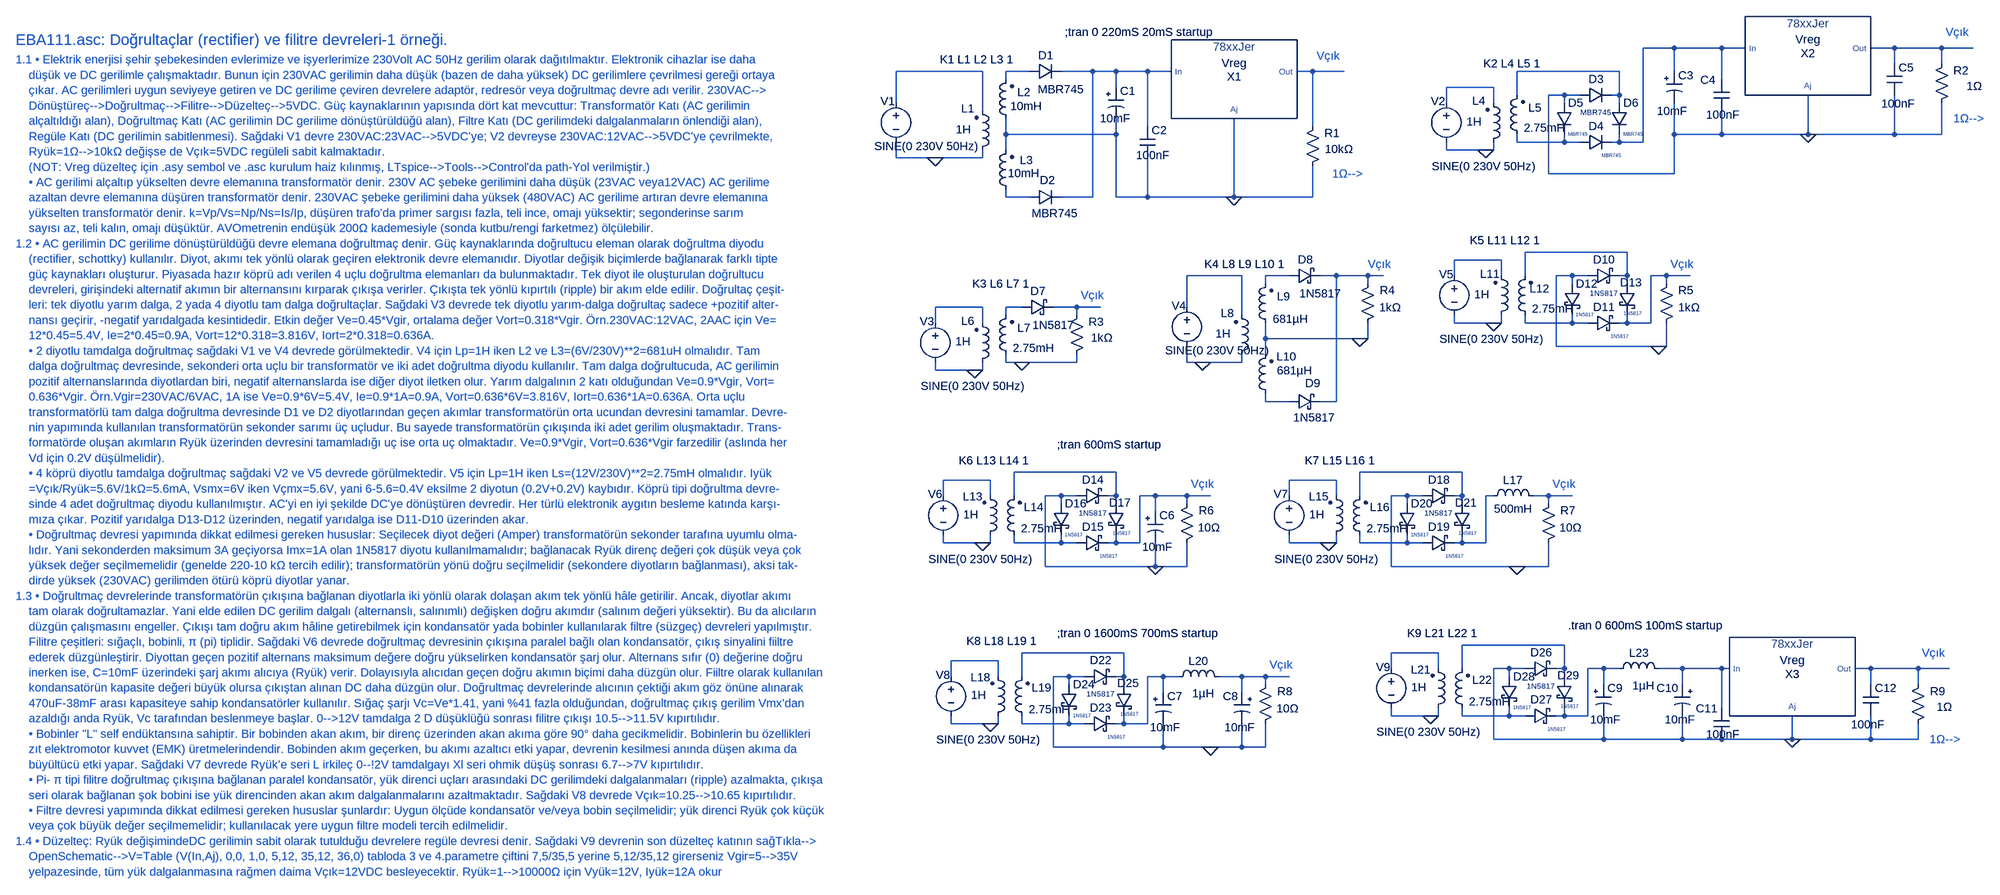
[diagram p0: schematic EBA111.asc]
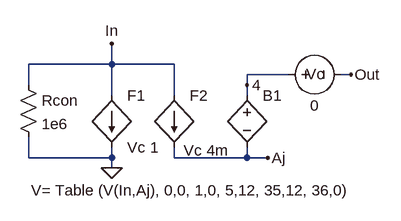
[diagram p1: sub-circuit 7805jerarq.asc]
EBA111.asc, the LTspice schematic file:
Version 4
SHEET 1 4648 4332
WIRE 3328 64 3264 64
WIRE 3424 64 3328 64
WIRE 3472 64 3424 64
WIRE 3776 64 3728 64
WIRE 3872 64 3776 64
WIRE 3936 64 3872 64
WIRE 3776 96 3776 64
WIRE 3872 96 3872 64
WIRE 1920 112 1744 112
WIRE 2016 112 1968 112
WIRE 2144 112 2080 112
WIRE 2192 112 2144 112
WIRE 2256 112 2192 112
WIRE 2304 112 2256 112
WIRE 2592 112 2560 112
WIRE 2656 112 2592 112
WIRE 3216 112 3008 112
WIRE 3328 112 3328 64
WIRE 1968 128 1968 112
WIRE 3424 128 3424 64
WIRE 2192 144 2192 112
WIRE 2960 144 2864 144
WIRE 3008 160 3008 112
WIRE 3104 160 3072 160
WIRE 3136 160 3104 160
WIRE 3216 160 3216 112
WIRE 3216 160 3200 160
WIRE 1744 176 1744 112
WIRE 2864 176 2864 144
WIRE 2960 176 2960 144
WIRE 3104 176 3104 160
WIRE 3216 176 3216 160
WIRE 1920 192 1920 112
WIRE 2256 224 2256 112
WIRE 2592 224 2592 112
WIRE 1968 240 1968 208
WIRE 2192 240 2192 208
WIRE 2192 240 1968 240
WIRE 3328 240 3328 176
WIRE 3424 240 3424 192
WIRE 3424 240 3328 240
WIRE 3600 240 3600 160
WIRE 3600 240 3424 240
WIRE 3776 240 3776 160
WIRE 3776 240 3600 240
WIRE 3872 240 3872 176
WIRE 3872 240 3776 240
WIRE 3008 256 3008 240
WIRE 3104 256 3104 240
WIRE 3104 256 3008 256
WIRE 3136 256 3104 256
WIRE 3216 256 3216 240
WIRE 3216 256 3200 256
WIRE 3264 256 3264 64
WIRE 3264 256 3216 256
WIRE 1968 272 1968 240
WIRE 2864 272 2864 256
WIRE 2944 272 2864 272
WIRE 2960 272 2960 256
WIRE 2960 272 2944 272
WIRE 1744 288 1744 256
WIRE 1824 288 1744 288
WIRE 1920 288 1920 272
WIRE 1920 288 1824 288
WIRE 3072 320 3072 160
WIRE 3328 320 3328 240
WIRE 3328 320 3072 320
WIRE 1968 368 1968 352
WIRE 2016 368 1968 368
WIRE 2144 368 2144 112
WIRE 2144 368 2080 368
WIRE 2192 368 2192 240
WIRE 2256 368 2256 288
WIRE 2256 368 2192 368
WIRE 2432 368 2432 208
WIRE 2432 368 2256 368
WIRE 2592 368 2592 304
WIRE 2592 368 2432 368
WIRE 3232 480 3024 480
WIRE 2976 496 2880 496
WIRE 2448 528 2336 528
WIRE 2544 528 2496 528
WIRE 2640 528 2608 528
WIRE 2704 528 2640 528
WIRE 2736 528 2704 528
WIRE 2880 528 2880 496
WIRE 2976 528 2976 496
WIRE 3024 528 3024 480
WIRE 3120 528 3088 528
WIRE 3152 528 3120 528
WIRE 3232 528 3232 480
WIRE 3232 528 3216 528
WIRE 3312 528 3280 528
WIRE 3360 528 3312 528
WIRE 2496 544 2496 528
WIRE 2704 544 2704 528
WIRE 3120 544 3120 528
WIRE 3232 544 3232 528
WIRE 3312 544 3312 528
WIRE 1920 592 1824 592
WIRE 2000 592 1968 592
WIRE 2112 592 2064 592
WIRE 2160 592 2112 592
WIRE 2336 592 2336 528
WIRE 1968 608 1968 592
WIRE 2112 608 2112 592
WIRE 2448 608 2448 528
WIRE 1824 624 1824 592
WIRE 1920 624 1920 592
WIRE 2880 624 2880 608
WIRE 2960 624 2880 624
WIRE 2976 624 2976 608
WIRE 2976 624 2960 624
WIRE 3024 624 3024 608
WIRE 3120 624 3120 608
WIRE 3120 624 3024 624
WIRE 3152 624 3120 624
WIRE 3232 624 3232 608
WIRE 3232 624 3216 624
WIRE 3280 624 3280 528
WIRE 3280 624 3232 624
WIRE 2496 656 2496 624
WIRE 2688 656 2496 656
WIRE 2704 656 2704 624
WIRE 2704 656 2688 656
WIRE 3088 672 3088 528
WIRE 3296 672 3088 672
WIRE 3312 672 3312 624
WIRE 3312 672 3296 672
WIRE 2496 688 2496 656
WIRE 1968 704 1968 688
WIRE 2000 704 1968 704
WIRE 2112 704 2112 688
WIRE 2112 704 2000 704
WIRE 2336 704 2336 672
WIRE 2368 704 2336 704
WIRE 2448 704 2448 688
WIRE 2448 704 2368 704
WIRE 1824 720 1824 704
WIRE 1904 720 1824 720
WIRE 1920 720 1920 704
WIRE 1920 720 1904 720
WIRE 2496 784 2496 768
WIRE 2544 784 2496 784
WIRE 2640 784 2640 528
WIRE 2640 784 2608 784
WIRE 2192 928 1984 928
WIRE 2896 928 2688 928
WIRE 1936 944 1840 944
WIRE 2640 944 2544 944
WIRE 1840 976 1840 944
WIRE 1936 976 1936 944
WIRE 1984 976 1984 928
WIRE 2080 976 2048 976
WIRE 2112 976 2080 976
WIRE 2192 976 2192 928
WIRE 2192 976 2176 976
WIRE 2272 976 2240 976
WIRE 2336 976 2272 976
WIRE 2384 976 2336 976
WIRE 2544 976 2544 944
WIRE 2640 976 2640 944
WIRE 2688 976 2688 928
WIRE 2784 976 2752 976
WIRE 2816 976 2784 976
WIRE 2896 976 2896 928
WIRE 2896 976 2880 976
WIRE 2960 976 2944 976
WIRE 3072 976 3040 976
WIRE 3120 976 3072 976
WIRE 2080 992 2080 976
WIRE 2192 992 2192 976
WIRE 2336 992 2336 976
WIRE 2784 992 2784 976
WIRE 2896 992 2896 976
WIRE 3072 992 3072 976
WIRE 2272 1008 2272 976
WIRE 1840 1072 1840 1056
WIRE 1920 1072 1840 1072
WIRE 1936 1072 1936 1056
WIRE 1936 1072 1920 1072
WIRE 1984 1072 1984 1056
WIRE 2080 1072 2080 1056
WIRE 2080 1072 1984 1072
WIRE 2112 1072 2080 1072
WIRE 2192 1072 2192 1056
WIRE 2192 1072 2176 1072
WIRE 2240 1072 2240 976
WIRE 2240 1072 2192 1072
WIRE 2544 1072 2544 1056
WIRE 2624 1072 2544 1072
WIRE 2640 1072 2640 1056
WIRE 2640 1072 2624 1072
WIRE 2688 1072 2688 1056
WIRE 2784 1072 2784 1056
WIRE 2784 1072 2688 1072
WIRE 2816 1072 2784 1072
WIRE 2896 1072 2896 1056
WIRE 2896 1072 2880 1072
WIRE 2944 1072 2944 976
WIRE 2944 1072 2896 1072
WIRE 2048 1120 2048 976
WIRE 2272 1120 2272 1072
WIRE 2272 1120 2048 1120
WIRE 2336 1120 2336 1072
WIRE 2336 1120 2272 1120
WIRE 2752 1120 2752 976
WIRE 3008 1120 2752 1120
WIRE 3072 1120 3072 1072
WIRE 3072 1120 3008 1120
WIRE 3104 1280 2896 1280
WIRE 2208 1296 2000 1296
WIRE 2848 1296 2752 1296
WIRE 1952 1312 1856 1312
WIRE 2752 1328 2752 1296
WIRE 2848 1328 2848 1296
WIRE 2896 1328 2896 1280
WIRE 2992 1328 2960 1328
WIRE 3024 1328 2992 1328
WIRE 3104 1328 3104 1280
WIRE 3104 1328 3088 1328
WIRE 3184 1328 3152 1328
WIRE 3216 1328 3184 1328
WIRE 3344 1328 3296 1328
WIRE 3424 1328 3344 1328
WIRE 3440 1328 3424 1328
WIRE 3728 1328 3696 1328
WIRE 3824 1328 3728 1328
WIRE 3888 1328 3824 1328
WIRE 1856 1344 1856 1312
WIRE 1952 1344 1952 1312
WIRE 2000 1344 2000 1296
WIRE 2096 1344 2064 1344
WIRE 2128 1344 2096 1344
WIRE 2208 1344 2208 1296
WIRE 2208 1344 2192 1344
WIRE 2288 1344 2256 1344
WIRE 2320 1344 2288 1344
WIRE 2448 1344 2400 1344
WIRE 2496 1344 2448 1344
WIRE 2544 1344 2496 1344
WIRE 2992 1344 2992 1328
WIRE 3104 1344 3104 1328
WIRE 2096 1360 2096 1344
WIRE 2208 1360 2208 1344
WIRE 2496 1360 2496 1344
WIRE 3184 1360 3184 1328
WIRE 3344 1360 3344 1328
WIRE 3728 1360 3728 1328
WIRE 3824 1360 3824 1328
WIRE 2288 1376 2288 1344
WIRE 2448 1376 2448 1344
WIRE 3424 1408 3424 1328
WIRE 2752 1424 2752 1408
WIRE 2832 1424 2752 1424
WIRE 2848 1424 2848 1408
WIRE 2848 1424 2832 1424
WIRE 2896 1424 2896 1408
WIRE 2992 1424 2992 1408
WIRE 2992 1424 2896 1424
WIRE 3024 1424 2992 1424
WIRE 3104 1424 3104 1408
WIRE 3104 1424 3088 1424
WIRE 3152 1424 3152 1328
WIRE 3152 1424 3104 1424
WIRE 1856 1440 1856 1424
WIRE 1936 1440 1856 1440
WIRE 1952 1440 1952 1424
WIRE 1952 1440 1936 1440
WIRE 2000 1440 2000 1424
WIRE 2096 1440 2096 1424
WIRE 2096 1440 2000 1440
WIRE 2128 1440 2096 1440
WIRE 2208 1440 2208 1424
WIRE 2208 1440 2192 1440
WIRE 2256 1440 2256 1344
WIRE 2256 1440 2208 1440
WIRE 2960 1472 2960 1328
WIRE 3184 1472 3184 1424
WIRE 3184 1472 2960 1472
WIRE 3344 1472 3344 1424
WIRE 3344 1472 3184 1472
WIRE 3424 1472 3344 1472
WIRE 3568 1472 3568 1424
WIRE 3568 1472 3424 1472
WIRE 3728 1472 3728 1424
WIRE 3728 1472 3568 1472
WIRE 3824 1472 3824 1440
WIRE 3824 1472 3728 1472
WIRE 2064 1488 2064 1344
WIRE 2288 1488 2288 1440
WIRE 2288 1488 2064 1488
WIRE 2384 1488 2288 1488
WIRE 2448 1488 2448 1440
WIRE 2448 1488 2384 1488
WIRE 2496 1488 2496 1440
WIRE 2496 1488 2448 1488
FLAG 2432 368 0
FLAG 1824 288 0
FLAG 3600 240 0
FLAG 2944 272 0
FLAG 1904 720 0
FLAG 2000 704 0
FLAG 2368 704 0
FLAG 2688 656 0
FLAG 2960 624 0
FLAG 3296 672 0
FLAG 1920 1072 0
FLAG 2272 1120 0
FLAG 2624 1072 0
FLAG 3008 1120 0
FLAG 1936 1440 0
FLAG 2384 1488 0
FLAG 2832 1424 0
FLAG 3568 1472 0
SYMBOL ind2 1984 224 R180
WINDOW 0 -34 70 Left 2
WINDOW 3 -57 41 Left 2
SYMATTR InstName L2
SYMATTR Value 10mH
SYMBOL ind2 1984 368 R180
WINDOW 0 -39 75 Left 2
WINDOW 3 -52 49 Left 2
SYMATTR InstName L3
SYMATTR Value 10mH
SYMBOL ind2 1904 288 M180
WINDOW 0 -27 100 Left 2
WINDOW 3 -38 58 Left 2
SYMATTR InstName L1
SYMATTR Value 1H
SYMATTR SpiceLine Rser=1
SYMBOL voltage 1744 160 R0
WINDOW 0 -31 13 Left 2
WINDOW 3 -44 104 Left 2
WINDOW 123 0 0 Left 0
WINDOW 39 0 0 Left 0
SYMATTR InstName V1
SYMATTR Value SINE(0 230V 50Hz)
SYMBOL diode 2016 128 R270
WINDOW 0 33 33 VTop 2
WINDOW 3 -5 64 VBottom 2
SYMATTR InstName D1
SYMATTR Value MBR745
SYMBOL diode 2016 384 R270
WINDOW 0 35 36 VTop 2
WINDOW 3 -1 51 VBottom 2
SYMATTR InstName D2
SYMATTR Value MBR745
SYMBOL polcap 2176 144 R0
WINDOW 3 -17 64 Left 2
SYMATTR Value 10mF
SYMATTR InstName C1
SYMATTR Description Capacitor
SYMATTR Type cap
SYMATTR SpiceLine V=10 Irms=3 Rser=0.017 MTBF=2000 Lser=0 mfg="Panasonic" pn="ECA1AFQ103" type="Al electrolytic" ppPkg=1
SYMBOL cap 2240 224 R0
WINDOW 3 -7 59 Left 2
SYMATTR Value 100nF
SYMATTR InstName C2
SYMBOL res 2608 208 M0
WINDOW 0 -39 30 Left 2
WINDOW 3 -67 62 Left 2
SYMATTR InstName R1
SYMATTR Value 10kΩ
SYMBOL 7805jerarq 2432 112 R0
WINDOW 38 0 -17 Center 2
WINDOW 0 0 11 Center 2
SYMATTR InstName X1
SYMBOL ind2 3024 256 R180
WINDOW 0 -34 70 Left 2
WINDOW 3 -83 29 Left 2
SYMATTR InstName L5
SYMATTR Value 2.75mH
SYMBOL ind2 2944 272 M180
WINDOW 0 -27 100 Left 2
WINDOW 3 -39 58 Left 2
SYMATTR InstName L4
SYMATTR Value 1H
SYMATTR SpiceLine Rser=1
SYMBOL voltage 2864 160 R0
WINDOW 0 -31 13 Left 2
WINDOW 3 -30 145 Left 2
WINDOW 123 0 0 Left 0
WINDOW 39 0 0 Left 0
SYMATTR InstName V2
SYMATTR Value SINE(0 230V 50Hz)
SYMBOL polcap 3312 112 R0
WINDOW 3 -19 81 Left 2
SYMATTR Value 10mF
SYMATTR InstName C3
SYMATTR Description Capacitor
SYMATTR Type cap
SYMATTR SpiceLine V=10 Irms=3 Rser=0.017 MTBF=2000 Lser=0 mfg="Panasonic" pn="ECA1AFQ103" type="Al electrolytic" ppPkg=1
SYMBOL cap 3408 128 R0
WINDOW 3 -15 72 Left 2
WINDOW 0 -27 1 Left 2
SYMATTR Value 100nF
SYMATTR InstName C4
SYMBOL res 3888 80 M0
WINDOW 0 -39 30 Left 2
WINDOW 3 -67 62 Left 2
SYMATTR InstName R2
SYMATTR Value 1Ω
SYMBOL 7805jerarq 3600 64 R0
WINDOW 38 0 -17 Center 2
WINDOW 0 0 11 Center 2
SYMATTR InstName X2
SYMBOL diode 3136 176 R270
WINDOW 0 33 33 VTop 2
WINDOW 3 -9 32 VBottom 1
SYMATTR InstName D3
SYMATTR Value MBR745
SYMBOL diode 3136 272 R270
WINDOW 0 33 33 VTop 2
WINDOW 3 -5 64 VBottom 0
SYMATTR InstName D4
SYMATTR Value MBR745
SYMBOL diode 3088 176 R0
WINDOW 3 24 64 Left 0
SYMATTR Value MBR745
SYMATTR InstName D5
SYMBOL diode 3200 176 R0
WINDOW 3 24 64 Left 0
SYMATTR Value MBR745
SYMATTR InstName D6
SYMBOL cap 3760 96 R0
WINDOW 3 -11 82 Left 2
SYMATTR Value 100nF
SYMATTR InstName C5
SYMBOL ind2 1984 704 R180
WINDOW 0 -34 70 Left 2
WINDOW 3 -83 29 Left 2
SYMATTR InstName L7
SYMATTR Value 2.75mH
SYMBOL ind2 1904 720 M180
WINDOW 0 -27 100 Left 2
WINDOW 3 -39 58 Left 2
SYMATTR InstName L6
SYMATTR Value 1H
SYMATTR SpiceLine Rser=1
SYMBOL voltage 1824 608 R0
WINDOW 0 -31 13 Left 2
WINDOW 3 -30 145 Left 2
WINDOW 123 0 0 Left 0
WINDOW 39 0 0 Left 0
SYMATTR InstName V3
SYMATTR Value SINE(0 230V 50Hz)
SYMBOL schottky 2000 608 R270
WINDOW 0 33 33 VTop 2
WINDOW 3 -5 64 VBottom 2
SYMATTR InstName D7
SYMATTR Value 1N5817
SYMATTR Description Diode
SYMATTR Type diode
SYMBOL res 2128 592 M0
WINDOW 0 -39 30 Left 2
WINDOW 3 -57 62 Left 2
SYMATTR InstName R3
SYMATTR Value 1kΩ
SYMBOL ind2 2512 640 R180
WINDOW 0 -34 70 Left 2
WINDOW 3 -70 24 Left 2
SYMATTR InstName L9
SYMATTR Value 681µH
SYMBOL ind2 2512 784 R180
WINDOW 0 -47 91 Left 2
WINDOW 3 -79 63 Left 2
SYMATTR InstName L10
SYMATTR Value 681µH
SYMBOL ind2 2432 704 M180
WINDOW 0 -27 100 Left 2
WINDOW 3 -38 58 Left 2
SYMATTR InstName L8
SYMATTR Value 1H
SYMATTR SpiceLine Rser=1
SYMBOL voltage 2336 576 R0
WINDOW 0 -31 13 Left 2
WINDOW 3 -44 104 Left 2
WINDOW 123 0 0 Left 0
WINDOW 39 0 0 Left 0
SYMATTR InstName V4
SYMATTR Value SINE(0 230V 50Hz)
SYMBOL schottky 2544 544 R270
WINDOW 0 33 33 VTop 2
WINDOW 3 -5 64 VBottom 2
SYMATTR InstName D8
SYMATTR Value 1N5817
SYMATTR Description Diode
SYMATTR Type diode
SYMBOL schottky 2544 800 R270
WINDOW 0 38 48 VTop 2
WINDOW 3 -1 51 VBottom 2
SYMATTR InstName D9
SYMATTR Value 1N5817
SYMATTR Description Diode
SYMATTR Type diode
SYMBOL res 2720 528 M0
WINDOW 0 -39 30 Left 2
WINDOW 3 -52 65 Left 2
SYMATTR InstName R4
SYMATTR Value 1kΩ
SYMBOL ind2 3040 624 R180
WINDOW 0 -34 70 Left 2
WINDOW 3 -83 29 Left 2
SYMATTR InstName L12
SYMATTR Value 2.75mH
SYMBOL ind2 2960 624 M180
WINDOW 0 -27 100 Left 2
WINDOW 3 -39 58 Left 2
SYMATTR InstName L11
SYMATTR Value 1H
SYMATTR SpiceLine Rser=1
SYMBOL voltage 2880 512 R0
WINDOW 0 -31 13 Left 2
WINDOW 3 -30 145 Left 2
WINDOW 123 0 0 Left 0
WINDOW 39 0 0 Left 0
SYMATTR InstName V5
SYMATTR Value SINE(0 230V 50Hz)
SYMBOL schottky 3152 544 R270
WINDOW 0 33 33 VTop 2
WINDOW 3 -9 32 VBottom 1
SYMATTR InstName D10
SYMATTR Value 1N5817
SYMATTR Description Diode
SYMATTR Type diode
SYMBOL schottky 3152 640 R270
WINDOW 0 33 33 VTop 2
WINDOW 3 -5 64 VBottom 0
SYMATTR InstName D11
SYMATTR Value 1N5817
SYMATTR Description Diode
SYMATTR Type diode
SYMBOL schottky 3104 544 R0
WINDOW 3 24 64 Left 0
SYMATTR Value 1N5817
SYMATTR InstName D12
SYMATTR Description Diode
SYMATTR Type diode
SYMBOL schottky 3216 544 R0
WINDOW 3 9 61 Left 0
WINDOW 0 2 -2 Left 2
SYMATTR Value 1N5817
SYMATTR InstName D13
SYMATTR Description Diode
SYMATTR Type diode
SYMBOL res 3328 528 M0
WINDOW 0 -39 30 Left 2
WINDOW 3 -52 65 Left 2
SYMATTR InstName R5
SYMATTR Value 1kΩ
SYMBOL ind2 2000 1072 R180
WINDOW 0 -45 73 Left 2
WINDOW 3 -83 29 Left 2
SYMATTR InstName L14
SYMATTR Value 2.75mH
SYMBOL ind2 1920 1072 M180
WINDOW 0 -40 94 Left 2
WINDOW 3 -39 58 Left 2
SYMATTR InstName L13
SYMATTR Value 1H
SYMATTR SpiceLine Rser=1
SYMBOL voltage 1840 960 R0
WINDOW 0 -31 13 Left 2
WINDOW 3 -30 145 Left 2
WINDOW 123 0 0 Left 0
WINDOW 39 0 0 Left 0
SYMATTR InstName V6
SYMATTR Value SINE(0 230V 50Hz)
SYMBOL schottky 2112 992 R270
WINDOW 0 33 33 VTop 2
WINDOW 3 -9 32 VBottom 1
SYMATTR InstName D14
SYMATTR Value 1N5817
SYMATTR Description Diode
SYMATTR Type diode
SYMBOL schottky 2112 1088 R270
WINDOW 0 33 33 VTop 2
WINDOW 3 -5 64 VBottom 0
SYMATTR InstName D15
SYMATTR Value 1N5817
SYMATTR Description Diode
SYMATTR Type diode
SYMBOL schottky 2064 992 R0
WINDOW 3 24 64 Left 0
SYMATTR Value 1N5817
SYMATTR InstName D16
SYMATTR Description Diode
SYMATTR Type diode
SYMBOL schottky 2176 992 R0
WINDOW 3 9 61 Left 0
WINDOW 0 2 -2 Left 2
SYMATTR Value 1N5817
SYMATTR InstName D17
SYMATTR Description Diode
SYMATTR Type diode
SYMBOL res 2352 976 M0
WINDOW 0 -39 30 Left 2
WINDOW 3 -52 65 Left 2
SYMATTR InstName R6
SYMATTR Value 10Ω
SYMBOL polcap 2256 1008 R0
WINDOW 3 -11 72 Left 2
SYMATTR Value 10mF
SYMATTR InstName C6
SYMATTR Description Capacitor
SYMATTR Type cap
SYMATTR SpiceLine V=10 Irms=3 Rser=0.017 MTBF=2000 Lser=0 mfg="Panasonic" pn="ECA1AFQ103" type="Al electrolytic" ppPkg=1
SYMBOL ind2 2704 1072 R180
WINDOW 0 -45 73 Left 2
WINDOW 3 -83 29 Left 2
SYMATTR InstName L16
SYMATTR Value 2.75mH
SYMBOL ind2 2624 1072 M180
WINDOW 0 -40 94 Left 2
WINDOW 3 -39 58 Left 2
SYMATTR InstName L15
SYMATTR Value 1H
SYMATTR SpiceLine Rser=1
SYMBOL voltage 2544 960 R0
WINDOW 0 -31 13 Left 2
WINDOW 3 -30 145 Left 2
WINDOW 123 0 0 Left 0
WINDOW 39 0 0 Left 0
SYMATTR InstName V7
SYMATTR Value SINE(0 230V 50Hz)
SYMBOL schottky 2816 992 R270
WINDOW 0 33 33 VTop 2
WINDOW 3 -9 32 VBottom 1
SYMATTR InstName D18
SYMATTR Value 1N5817
SYMATTR Description Diode
SYMATTR Type diode
SYMBOL schottky 2816 1088 R270
WINDOW 0 33 33 VTop 2
WINDOW 3 -5 64 VBottom 0
SYMATTR InstName D19
SYMATTR Value 1N5817
SYMATTR Description Diode
SYMATTR Type diode
SYMBOL schottky 2768 992 R0
WINDOW 3 24 64 Left 0
SYMATTR Value 1N5817
SYMATTR InstName D20
SYMATTR Description Diode
SYMATTR Type diode
SYMBOL schottky 2880 992 R0
WINDOW 3 9 61 Left 0
WINDOW 0 2 -2 Left 2
SYMATTR Value 1N5817
SYMATTR InstName D21
SYMATTR Description Diode
SYMATTR Type diode
SYMBOL res 3088 976 M0
WINDOW 0 -39 30 Left 2
WINDOW 3 -52 65 Left 2
SYMATTR InstName R7
SYMATTR Value 10Ω
SYMBOL ind 2944 992 R270
WINDOW 0 32 56 VTop 2
WINDOW 3 5 56 VBottom 2
SYMATTR InstName L17
SYMATTR Value 500mH
SYMBOL ind2 2016 1440 R180
WINDOW 0 -45 73 Left 2
WINDOW 3 -83 29 Left 2
SYMATTR InstName L19
SYMATTR Value 2.75mH
SYMBOL ind2 1936 1440 M180
WINDOW 0 -40 94 Left 2
WINDOW 3 -39 58 Left 2
SYMATTR InstName L18
SYMATTR Value 1H
SYMATTR SpiceLine Rser=1
SYMBOL voltage 1856 1328 R0
WINDOW 0 -31 13 Left 2
WINDOW 3 -30 145 Left 2
WINDOW 123 0 0 Left 0
WINDOW 39 0 0 Left 0
SYMATTR InstName V8
SYMATTR Value SINE(0 230V 50Hz)
SYMBOL schottky 2128 1360 R270
WINDOW 0 33 33 VTop 2
WINDOW 3 -9 32 VBottom 1
SYMATTR InstName D22
SYMATTR Value 1N5817
SYMATTR Description Diode
SYMATTR Type diode
SYMBOL schottky 2128 1456 R270
WINDOW 0 33 33 VTop 2
WINDOW 3 -5 64 VBottom 0
SYMATTR InstName D23
SYMATTR Value 1N5817
SYMATTR Description Diode
SYMATTR Type diode
SYMBOL schottky 2080 1360 R0
WINDOW 3 24 64 Left 0
SYMATTR Value 1N5817
SYMATTR InstName D24
SYMATTR Description Diode
SYMATTR Type diode
SYMBOL schottky 2192 1360 R0
WINDOW 3 9 61 Left 0
WINDOW 0 2 -2 Left 2
SYMATTR Value 1N5817
SYMATTR InstName D25
SYMATTR Description Diode
SYMATTR Type diode
SYMBOL res 2512 1344 M0
WINDOW 0 -39 30 Left 2
WINDOW 3 -52 65 Left 2
SYMATTR InstName R8
SYMATTR Value 10Ω
SYMBOL ind 2304 1360 R270
WINDOW 0 32 56 VTop 2
WINDOW 3 -3 65 VBottom 2
SYMATTR InstName L20
SYMATTR Value 1µH
SYMBOL polcap 2272 1376 R0
WINDOW 3 -11 72 Left 2
SYMATTR Value 10mF
SYMATTR InstName C7
SYMATTR Description Capacitor
SYMATTR Type cap
SYMATTR SpiceLine V=10 Irms=3 Rser=0.017 MTBF=2000 Lser=0 mfg="Panasonic" pn="ECA1AFQ103" type="Al electrolytic" ppPkg=1
SYMBOL polcap 2464 1376 M0
WINDOW 3 -11 72 Left 2
SYMATTR Value 10mF
SYMATTR InstName C8
SYMATTR Description Capacitor
SYMATTR Type cap
SYMATTR SpiceLine V=10 Irms=3 Rser=0.017 MTBF=2000 Lser=0 mfg="Panasonic" pn="ECA1AFQ103" type="Al electrolytic" ppPkg=1
SYMBOL ind2 2912 1424 R180
WINDOW 0 -45 73 Left 2
WINDOW 3 -83 29 Left 2
SYMATTR InstName L22
SYMATTR Value 2.75mH
SYMBOL ind2 2832 1424 M180
WINDOW 0 -40 94 Left 2
WINDOW 3 -39 58 Left 2
SYMATTR InstName L21
SYMATTR Value 1H
SYMATTR SpiceLine Rser=1
SYMBOL voltage 2752 1312 R0
WINDOW 0 -31 13 Left 2
WINDOW 3 -30 145 Left 2
WINDOW 123 0 0 Left 0
WINDOW 39 0 0 Left 0
SYMATTR InstName V9
SYMATTR Value SINE(0 230V 50Hz)
SYMBOL schottky 3024 1344 R270
WINDOW 0 33 33 VTop 2
WINDOW 3 -9 32 VBottom 1
SYMATTR InstName D26
SYMATTR Value 1N5817
SYMATTR Description Diode
SYMATTR Type diode
SYMBOL schottky 3024 1440 R270
WINDOW 0 33 33 VTop 2
WINDOW 3 -5 64 VBottom 0
SYMATTR InstName D27
SYMATTR Value 1N5817
SYMATTR Description Diode
SYMATTR Type diode
SYMBOL schottky 2976 1344 R0
WINDOW 3 24 64 Left 0
SYMATTR Value 1N5817
SYMATTR InstName D28
SYMATTR Description Diode
SYMATTR Type diode
SYMBOL schottky 3088 1344 R0
WINDOW 3 9 61 Left 0
WINDOW 0 2 -2 Left 2
SYMATTR Value 1N5817
SYMATTR InstName D29
SYMATTR Description Diode
SYMATTR Type diode
SYMBOL ind 3200 1344 R270
WINDOW 0 32 56 VTop 2
WINDOW 3 -3 65 VBottom 2
SYMATTR InstName L23
SYMATTR Value 1µH
SYMBOL polcap 3168 1360 R0
WINDOW 3 -11 72 Left 2
SYMATTR Value 10mF
SYMATTR InstName C9
SYMATTR Description Capacitor
SYMATTR Type cap
SYMATTR SpiceLine V=10 Irms=3 Rser=0.017 MTBF=2000 Lser=0 mfg="Panasonic" pn="ECA1AFQ103" type="Al electrolytic" ppPkg=1
SYMBOL polcap 3360 1360 M0
WINDOW 3 -11 72 Left 2
SYMATTR Value 10mF
SYMATTR InstName C10
SYMATTR Description Capacitor
SYMATTR Type cap
SYMATTR SpiceLine V=10 Irms=3 Rser=0.017 MTBF=2000 Lser=0 mfg="Panasonic" pn="ECA1AFQ103" type="Al electrolytic" ppPkg=1
SYMBOL cap 3408 1408 R0
WINDOW 3 -15 54 Left 2
WINDOW 0 -36 1 Left 2
SYMATTR Value 100nF
SYMATTR InstName C11
SYMBOL res 3840 1344 M0
WINDOW 0 -39 30 Left 2
WINDOW 3 -54 62 Left 2
SYMATTR InstName R9
SYMATTR Value 1Ω
SYMBOL 7805jerarq 3568 1328 R0
WINDOW 38 0 -17 Center 2
WINDOW 0 0 11 Center 2
SYMATTR InstName X3
SYMBOL cap 3712 1360 R0
WINDOW 3 -24 82 Left 2
SYMATTR Value 100nF
SYMATTR InstName C12
TEXT -144 48 Left 3 ;EBA111.asc: Doğrultaçlar (rectifier) ve filitre devreleri-1 örneği.
TEXT -144 88 Left 2 ;1.1 • Elektrik enerjisi şehir şebekesinden evlerimize ve işyerlerimize 230Volt AC 50Hz gerilim olarak dağıtılmaktır. Elektronik cihazlar ise daha\n    düşük ve DC gerilimle çalışmaktadır. Bunun için 230VAC gerilimin daha düşük (bazen de daha yüksek) DC gerilimlere çevrilmesi gereği ortaya\n    çıkar. AC gerilimleri uygun seviyeye getiren ve DC gerilime çeviren devrelere adaptör, redresör veya doğrultmaç devre adı verilir. 230VAC-->\n    Dönüştüreç-->Doğrultmaç-->Filitre-->Düzelteç-->5VDC. Güç kaynaklarının yapısında dört kat mevcuttur: Transformatör Katı (AC gerilimin \n    alçaltıldığı alan), Doğrultmaç Katı (AC gerilimin DC gerilime dönüştürüldüğü alan), Filtre Katı (DC gerilimdeki dalgalanmaların önlendiği alan),\n    Regüle Katı (DC gerilimin sabitlenmesi). Sağdaki V1 devre 230VAC:23VAC-->5VDC'ye; V2 devreyse 230VAC:12VAC-->5VDC'ye çevrilmekte,\n    Ryük=1Ω-->10kΩ değişse de Vçık=5VDC regüleli sabit kalmaktadır.\n    (NOT: Vreg düzelteç için .asy sembol ve .asc kurulum haiz kılınmış, LTspice-->Tools-->Control'da path-Yol verilmiştir.)\n    • AC gerilimi alçaltıp yükselten devre elemanına transformatör denir. 230V AC şebeke gerilimini daha düşük (23VAC veya12VAC) AC gerilime\n    azaltan devre elemanına düşüren transformatör denir. 230VAC şebeke gerilimini daha yüksek (480VAC) AC gerilime artıran devre elemanına\n    yükselten transformatör denir. k=Vp/Vs=Np/Ns=Is/Ip, düşüren trafo'da primer sargısı fazla, teli ince, omajı yüksektir; segonderinse sarım \n    sayısı az, teli kalın, omajı düşüktür. AVOmetrenin endüşük 200Ω kademesiyle (sonda kutbu/rengi farketmez) ölçülebilir.\n1.2 • AC gerilimin DC gerilime dönüştürüldüğü devre elemana doğrultmaç denir. Güç kaynaklarında doğrultucu eleman olarak doğrultma diyodu \n    (rectifier, schottky) kullanılır. Diyot, akımı tek yönlü olarak geçiren elektronik devre elemanıdır. Diyotlar değişik biçimlerde bağlanarak farklı tipte\n    güç kaynakları oluşturur. Piyasada hazır köprü adı verilen 4 uçlu doğrultma elemanları da bulunmaktadır. Tek diyot ile oluşturulan doğrultucu \n    devreleri, girişindeki alternatif akımın bir alternansını kırparak çıkışa verirler. Çıkışta tek yönlü kıpırtılı (ripple) bir akım elde edilir. Doğrultaç çeşit-\n    leri: tek diyotlu yarım dalga, 2 yada 4 diyotlu tam dalga doğrultaçlar. Sağdaki V3 devrede tek diyotlu yarım-dalga doğrultaç sadece +pozitif alter-\n    nansı geçirir, -negatif yarıdalgada kesintidedir. Etkin değer Ve=0.45*Vgir, ortalama değer Vort=0.318*Vgir. Örn.230VAC:12VAC, 2AAC için Ve=\n    12*0.45=5.4V, Ie=2*0.45=0.9A, Vort=12*0.318=3.816V, Iort=2*0.318=0.636A.\n    • 2 diyotlu tamdalga doğrultmaç sağdaki V1 ve V4 devrede görülmektedir. V4 için Lp=1H iken L2 ve L3=(6V/230V)**2=681uH olmalıdır. Tam \n    dalga doğrultmaç devresinde, sekonderi orta uçlu bir transformatör ve iki adet doğrultma diyodu kullanılır. Tam dalga doğrultucuda, AC gerilimin \n    pozitif alternanslarında diyotlardan biri, negatif alternanslarda ise diğer diyot iletken olur. Yarım dalgalının 2 katı olduğundan Ve=0.9*Vgir, Vort=\n    0.636*Vgir. Örn.Vgir=230VAC/6VAC, 1A ise Ve=0.9*6V=5.4V, Ie=0.9*1A=0.9A, Vort=0.636*6V=3.816V, Iort=0.636*1A=0.636A. Orta uçlu\n    transformatörlü tam dalga doğrultma devresinde D1 ve D2 diyotlarından geçen akımlar transformatörün orta ucundan devresini tamamlar. Devre-\n    nin yapımında kullanılan transformatörün sekonder sarımı üç uçludur. Bu sayede transformatörün çıkışında iki adet gerilim oluşmaktadır. Trans-\n    formatörde oluşan akımların Ryük üzerinden devresini tamamladığı uç ise orta uç olmaktadır. Ve=0.9*Vgir, Vort=0.636*Vgir farzedilir (aslında her\n    Vd için 0.2V düşülmelidir).\n    • 4 köprü diyotlu tamdalga doğrultmaç sağdaki V2 ve V5 devrede görülmektedir. V5 için Lp=1H iken Ls=(12V/230V)**2=2.75mH olmalıdır. Iyük\n    =Vçık/Ryük=5.6V/1kΩ=5.6mA, Vsmx=6V iken Vçmx=5.6V, yani 6-5.6=0.4V eksilme 2 diyotun (0.2V+0.2V) kaybıdır. Köprü tipi doğrultma devre-\n    sinde 4 adet doğrultmaç diyodu kullanılmıştır. AC'yi en iyi şekilde DC'ye dönüştüren devredir. Her türlü elektronik aygıtın besleme katında karşı-\n    mıza çıkar. Pozitif yarıdalga D13-D12 üzerinden, negatif yarıdalga ise D11-D10 üzerinden akar.\n    • Doğrultmaç devresi yapımında dikkat edilmesi gereken hususlar: Seçilecek diyot değeri (Amper) transformatörün sekonder tarafına uyumlu olma-\n    lıdır. Yani sekonderden maksimum 3A geçiyorsa Imx=1A olan 1N5817 diyotu kullanılmamalıdır; bağlanacak Ryük direnç değeri çok düşük veya çok\n    yüksek değer seçilmemelidir (genelde 220-10 kΩ tercih edilir); transformatörün yönü doğru seçilmelidir (sekondere diyotların bağlanması), aksi tak-\n    dirde yüksek (230VAC) gerilimden ötürü köprü diyotlar yanar.\n1.3 • Doğrultmaç devrelerinde transformatörün çıkışına bağlanan diyotlarla iki yönlü olarak dolaşan akım tek yönlü hâle getirilir. Ancak, diyotlar akımı \n    tam olarak doğrultamazlar. Yani elde edilen DC gerilim dalgalı (alternanslı, salınımlı) değişken doğru akımdır (salınım değeri yüksektir). Bu da alıcıların \n    düzgün çalışmasını engeller. Çıkışı tam doğru akım hâline getirebilmek için kondansatör yada bobinler kullanılarak filtre (süzgeç) devreleri yapılmıştır.\n    Filitre çeşitleri: sığaçlı, bobinli, π (pi) tiplidir. Sağdaki V6 devrede doğrultmaç devresinin çıkışına paralel bağlı olan kondansatör, çıkış sinyalini fiiltre \n    ederek düzgünleştirir. Diyottan geçen pozitif alternans maksimum değere doğru yükselirken kondansatör şarj olur. Alternans sıfır (0) değerine doğru\n    inerken ise, C=10mF üzerindeki şarj akımı alıcıya (Ryük) verir. Dolayısıyla alıcıdan geçen doğru akımın biçimi daha düzgün olur. Fiiltre olarak kullanılan \n    kondansatörün kapasite değeri büyük olursa çıkıştan alınan DC daha düzgün olur. Doğrultmaç devrelerinde alıcının çektiği akım göz önüne alınarak\n    470uF-38mF arası kapasiteye sahip kondansatörler kullanılır. Sığaç şarjı Vc=Ve*1.41, yani %41 fazla olduğundan, doğrultmaç çıkış gerilim Vmx'dan\n    azaldığı anda Ryük, Vc tarafından beslenmeye başlar. 0-->12V tamdalga 2 D düşüklüğü sonrası filitre çıkışı 10.5-->11.5V kıpırtılıdır.\n    • Bobinler "L" self endüktansına sahiptir. Bir bobinden akan akım, bir direnç üzerinden akan akıma göre 90° daha gecikmelidir. Bobinlerin bu özellikleri\n    zıt elektromotor kuvvet (EMK) üretmelerindendir. Bobinden akım geçerken, bu akımı azaltıcı etki yapar, devrenin kesilmesi anında düşen akıma da \n    büyültücü etki yapar. Sağdaki V7 devrede Ryük'e seri L irkileç 0--!2V tamdalgayı Xl seri ohmik düşüş sonrası 6.7-->7V kıpırtılıdır.\n    • Pi- π tipi filitre doğrultmaç çıkışına bağlanan paralel kondansatör, yük direnci uçları arasındaki DC gerilimdeki dalgalanmaları (ripple) azalmakta, çıkışa\n    seri olarak bağlanan şok bobini ise yük direncinden akan akım dalgalanmalarını azaltmaktadır. Sağdaki V8 devrede Vçık=10.25-->10.65 kıpırtılıdır.\n    • Filtre devresi yapımında dikkat edilmesi gereken hususlar şunlardır: Uygun ölçüde kondansatör ve/veya bobin seçilmelidir; yük direnci Ryük çok küçük \n    veya çok büyük değer seçilmemelidir; kullanılacak yere uygun filtre modeli tercih edilmelidir.\n1.4 • Düzelteç: Ryük değişimindeDC gerilimin sabit olarak tutulduğu devrelere regüle devresi denir. Sağdaki V9 devrenin son düzelteç katının sağTıkla-->\n    OpenSchematic-->V=Table (V(In,Aj), 0,0, 1,0, 5,12, 35,12, 36,0) tabloda 3 ve 4.parametre çiftini 7,5/35,5 yerine 5,12/35,12 girerseniz Vgir=5-->35V\n    yelpazesinde, tüm yük dalgalanmasına rağmen daima Vçık=12VDC besleyecektir. Ryük=1-->10000Ω için Vyük=12V, Iyük=12A okur
TEXT 1984 88 Right 2 !K1 L1 L2 L3 1
TEXT 2088 32 Left 2 !;tran 0 220mS 20mS startup
TEXT 2600 80 Left 2 ;Vçık
TEXT 3056 96 Right 2 !K2 L4 L5 1
TEXT 3880 32 Left 2 ;Vçık
TEXT 2632 320 Left 2 ;1Ω-->
TEXT 3896 208 Left 2 ;1Ω-->
TEXT 2016 544 Right 2 !K3 L6 L7 1
TEXT 2120 568 Left 2 ;Vçık
TEXT 2536 504 Right 2 !K4 L8 L9 L10 1
TEXT 2704 504 Left 2 ;Vçık
TEXT 3056 456 Right 2 !K5 L11 L12 1
TEXT 3320 504 Left 2 ;Vçık
TEXT 2016 904 Right 2 !K6 L13 L14 1
TEXT 2344 952 Left 2 ;Vçık
TEXT 2072 872 Left 2 !;tran 600mS startup
TEXT 2720 904 Right 2 !K7 L15 L16 1
TEXT 3080 952 Left 2 ;Vçık
TEXT 2032 1272 Right 2 !K8 L18 L19 1
TEXT 2504 1320 Left 2 ;Vçık
TEXT 2072 1256 Left 2 !;tran 0 1600mS 700mS startup
TEXT 2928 1256 Right 2 !K9 L21 L22 1
TEXT 3832 1296 Left 2 ;Vçık
TEXT 3848 1472 Left 2 ;1Ω-->
TEXT 3112 1240 Left 2 !.tran 0 600mS 100mS startup

7805jerarq.asc, the sub-circuit schematic file:
Version 4
SHEET 1 880 680
WIRE -16 208 -16 176
WIRE -16 208 -144 208
WIRE 80 208 -16 208
WIRE 256 224 192 224
WIRE 352 224 336 224
WIRE -144 240 -144 208
WIRE 192 240 192 224
WIRE -16 256 -16 208
WIRE 80 256 80 208
WIRE 192 256 192 240
WIRE -144 352 -144 320
WIRE -16 352 -16 336
WIRE -16 352 -144 352
WIRE 80 352 80 336
WIRE 192 352 192 336
WIRE 192 352 80 352
WIRE 224 352 192 352
WIRE -16 368 -16 352
FLAG -16 368 0
FLAG -16 176 In
FLAG 192 240 4
FLAG 224 352 Aj
FLAG 352 224 Out
SYMBOL f -16 256 R0
SYMATTR InstName F1
SYMATTR Value Vc 1
SYMBOL res -160 224 R0
SYMATTR InstName Rcon
SYMATTR Value 1e6
SYMBOL bv 192 240 R0
WINDOW 3 -332 162 Left 0
SYMATTR Value V= Table (V(In,Aj), 0,0, 1,0, 5,12, 35,12, 36,0)
SYMATTR InstName B1
SYMBOL voltage 240 224 R270
WINDOW 0 -15 57 VTop 0
WINDOW 3 -32 56 VBottom 0
SYMATTR InstName Vc
SYMATTR Value 0
SYMBOL f 80 256 R0
WINDOW 3 15 85 Left 0
SYMATTR Value Vc 4m
SYMATTR InstName F2

The netlist it stands for:
* EBA111.asc
L2 0 N004 10mH
L3 N010 0 10mH
L1 0 N003 1H Rser=1
V1 N003 0 SINE(0 230V 50Hz)
D1 N004 N005 MBR745
D2 N010 N005 MBR745
C1 N005 0 10mF V=10 Irms=3 Rser=0.017 MTBF=2000 Lser=0 mfg="Panasonic" pn="ECA1AFQ103" type="Al electrolytic" ppPkg=1
C2 N005 0 100nF
R1 N006 0 10kΩ
XX1 N005 0 N006 7805jerarq
L5 N009 N007 2.75mH
L4 0 N008 1H Rser=1
V2 N008 0 SINE(0 230V 50Hz)
C3 N001 0 10mF V=10 Irms=3 Rser=0.017 MTBF=2000 Lser=0 mfg="Panasonic" pn="ECA1AFQ103" type="Al electrolytic" ppPkg=1
C4 N001 0 100nF
R2 N002 0 1Ω
XX2 N001 0 N002 7805jerarq
D3 0 N007 MBR745
D4 N009 N001 MBR745
D5 0 N009 MBR745
D6 N007 N001 MBR745
C5 N002 0 100nF
L7 0 N018 2.75mH
L6 0 N017 1H Rser=1
V3 N017 0 SINE(0 230V 50Hz)
D7 N018 N019 1N5817
R3 N019 0 1kΩ
L9 0 N014 681µH
L10 N021 0 681µH
L8 0 N013 1H Rser=1
V4 N013 0 SINE(0 230V 50Hz)
D8 N014 N015 1N5817
D9 N021 N015 1N5817
R4 N015 0 1kΩ
L12 N020 N011 2.75mH
L11 0 N012 1H Rser=1
V5 N012 0 SINE(0 230V 50Hz)
D10 0 N011 1N5817
D11 N020 N016 1N5817
D12 0 N020 1N5817
D13 N011 N016 1N5817
R5 N016 0 1kΩ
L14 N029 N022 2.75mH
L13 0 N024 1H Rser=1
V6 N024 0 SINE(0 230V 50Hz)
D14 0 N022 1N5817
D15 N029 N026 1N5817
D16 0 N029 1N5817
D17 N022 N026 1N5817
R6 N026 0 10Ω
C6 N026 0 10mF V=10 Irms=3 Rser=0.017 MTBF=2000 Lser=0 mfg="Panasonic" pn="ECA1AFQ103" type="Al electrolytic" ppPkg=1
L16 N030 N023 2.75mH
L15 0 N025 1H Rser=1
V7 N025 0 SINE(0 230V 50Hz)
D18 0 N023 1N5817
D19 N030 N027 1N5817
D20 0 N030 1N5817
D21 N023 N027 1N5817
R7 N028 0 10Ω
L17 N027 N028 500mH
L19 N041 N032 2.75mH
L18 0 N034 1H Rser=1
V8 N034 0 SINE(0 230V 50Hz)
D22 0 N032 1N5817
D23 N041 N038 1N5817
D24 0 N041 1N5817
D25 N032 N038 1N5817
R8 N039 0 10Ω
L20 N038 N039 1µH
C7 N038 0 10mF V=10 Irms=3 Rser=0.017 MTBF=2000 Lser=0 mfg="Panasonic" pn="ECA1AFQ103" type="Al electrolytic" ppPkg=1
C8 N039 0 10mF V=10 Irms=3 Rser=0.017 MTBF=2000 Lser=0 mfg="Panasonic" pn="ECA1AFQ103" type="Al electrolytic" ppPkg=1
L22 N040 N031 2.75mH
L21 0 N033 1H Rser=1
V9 N033 0 SINE(0 230V 50Hz)
D26 0 N031 1N5817
D27 N040 N035 1N5817
D28 0 N040 1N5817
D29 N031 N035 1N5817
L23 N035 N036 1µH
C9 N035 0 10mF V=10 Irms=3 Rser=0.017 MTBF=2000 Lser=0 mfg="Panasonic" pn="ECA1AFQ103" type="Al electrolytic" ppPkg=1
C10 N036 0 10mF V=10 Irms=3 Rser=0.017 MTBF=2000 Lser=0 mfg="Panasonic" pn="ECA1AFQ103" type="Al electrolytic" ppPkg=1
C11 N036 0 100nF
R9 N037 0 1Ω
XX3 N036 0 N037 7805jerarq
C12 N037 0 100nF

* block symbol definitions
.subckt 7805jerarq In Aj Out
F1 In 0 Vc 1
Rcon In 0 1e6
B1 4 Aj V= Table (V(In,Aj), 0,0, 1,0, 5,12, 35,12, 36,0)
Vc 4 Out 0
F2 In Aj Vc 4m
.ends 7805jerarq

.model D D
.lib standard.dio
* EBA111.asc: Doğrultaçlar (rectifier) ve filitre devreleri-1 örneği.
* 1.1 • Elektrik enerjisi şehir şebekesinden evlerimize ve işyerlerimize 230Volt AC 50Hz gerilim olarak dağıtılmaktır. Elektronik cihazlar ise daha
*     düşük ve DC gerilimle çalışmaktadır. Bunun için 230VAC gerilimin daha düşük (bazen de daha yüksek) DC gerilimlere çevrilmesi gereği ortaya
*     çıkar. AC gerilimleri uygun seviyeye getiren ve DC gerilime çeviren devrelere adaptör, redresör veya doğrultmaç devre adı verilir. 230VAC-->
*     Dönüştüreç-->Doğrultmaç-->Filitre-->Düzelteç-->5VDC. Güç kaynaklarının yapısında dört kat mevcuttur: Transformatör Katı (AC gerilimin
*     alçaltıldığı alan), Doğrultmaç Katı (AC gerilimin DC gerilime dönüştürüldüğü alan), Filtre Katı (DC gerilimdeki dalgalanmaların önlendiği alan),
*     Regüle Katı (DC gerilimin sabitlenmesi). Sağdaki V1 devre 230VAC:23VAC-->5VDC'ye; V2 devreyse 230VAC:12VAC-->5VDC'ye çevrilmekte,
*     Ryük=1Ω-->10kΩ değişse de Vçık=5VDC regüleli sabit kalmaktadır.
*     (NOT: Vreg düzelteç için .asy sembol ve .asc kurulum haiz kılınmış, LTspice-->Tools-->Control'da path-Yol verilmiştir.)
*     • AC gerilimi alçaltıp yükselten devre elemanına transformatör denir. 230V AC şebeke gerilimini daha düşük (23VAC veya12VAC) AC gerilime
*     azaltan devre elemanına düşüren transformatör denir. 230VAC şebeke gerilimini daha yüksek (480VAC) AC gerilime artıran devre elemanına
*     yükselten transformatör denir. k=Vp/Vs=Np/Ns=Is/Ip, düşüren trafo'da primer sargısı fazla, teli ince, omajı yüksektir; segonderinse sarım
*     sayısı az, teli kalın, omajı düşüktür. AVOmetrenin endüşük 200Ω kademesiyle (sonda kutbu/rengi farketmez) ölçülebilir.
* 1.2 • AC gerilimin DC gerilime dönüştürüldüğü devre elemana doğrultmaç denir. Güç kaynaklarında doğrultucu eleman olarak doğrultma diyodu
*     (rectifier, schottky) kullanılır. Diyot, akımı tek yönlü olarak geçiren elektronik devre elemanıdır. Diyotlar değişik biçimlerde bağlanarak farklı tipte
*     güç kaynakları oluşturur. Piyasada hazır köprü adı verilen 4 uçlu doğrultma elemanları da bulunmaktadır. Tek diyot ile oluşturulan doğrultucu
*     devreleri, girişindeki alternatif akımın bir alternansını kırparak çıkışa verirler. Çıkışta tek yönlü kıpırtılı (ripple) bir akım elde edilir. Doğrultaç çeşit-
*     leri: tek diyotlu yarım dalga, 2 yada 4 diyotlu tam dalga doğrultaçlar. Sağdaki V3 devrede tek diyotlu yarım-dalga doğrultaç sadece +pozitif alter-
*     nansı geçirir, -negatif yarıdalgada kesintidedir. Etkin değer Ve=0.45*Vgir, ortalama değer Vort=0.318*Vgir. Örn.230VAC:12VAC, 2AAC için Ve=
*     12*0.45=5.4V, Ie=2*0.45=0.9A, Vort=12*0.318=3.816V, Iort=2*0.318=0.636A.
*     • 2 diyotlu tamdalga doğrultmaç sağdaki V1 ve V4 devrede görülmektedir. V4 için Lp=1H iken L2 ve L3=(6V/230V)**2=681uH olmalıdır. Tam
*     dalga doğrultmaç devresinde, sekonderi orta uçlu bir transformatör ve iki adet doğrultma diyodu kullanılır. Tam dalga doğrultucuda, AC gerilimin
*     pozitif alternanslarında diyotlardan biri, negatif alternanslarda ise diğer diyot iletken olur. Yarım dalgalının 2 katı olduğundan Ve=0.9*Vgir, Vort=
*     0.636*Vgir. Örn.Vgir=230VAC/6VAC, 1A ise Ve=0.9*6V=5.4V, Ie=0.9*1A=0.9A, Vort=0.636*6V=3.816V, Iort=0.636*1A=0.636A. Orta uçlu
*     transformatörlü tam dalga doğrultma devresinde D1 ve D2 diyotlarından geçen akımlar transformatörün orta ucundan devresini tamamlar. Devre-
*     nin yapımında kullanılan transformatörün sekonder sarımı üç uçludur. Bu sayede transformatörün çıkışında iki adet gerilim oluşmaktadır. Trans-
*     formatörde oluşan akımların Ryük üzerinden devresini tamamladığı uç ise orta uç olmaktadır. Ve=0.9*Vgir, Vort=0.636*Vgir farzedilir (aslında her
*     Vd için 0.2V düşülmelidir).
*     • 4 köprü diyotlu tamdalga doğrultmaç sağdaki V2 ve V5 devrede görülmektedir. V5 için Lp=1H iken Ls=(12V/230V)**2=2.75mH olmalıdır. Iyük
*     =Vçık/Ryük=5.6V/1kΩ=5.6mA, Vsmx=6V iken Vçmx=5.6V, yani 6-5.6=0.4V eksilme 2 diyotun (0.2V+0.2V) kaybıdır. Köprü tipi doğrultma devre-
*     sinde 4 adet doğrultmaç diyodu kullanılmıştır. AC'yi en iyi şekilde DC'ye dönüştüren devredir. Her türlü elektronik aygıtın besleme katında karşı-
*     mıza çıkar. Pozitif yarıdalga D13-D12 üzerinden, negatif yarıdalga ise D11-D10 üzerinden akar.
*     • Doğrultmaç devresi yapımında dikkat edilmesi gereken hususlar: Seçilecek diyot değeri (Amper) transformatörün sekonder tarafına uyumlu olma-
*     lıdır. Yani sekonderden maksimum 3A geçiyorsa Imx=1A olan 1N5817 diyotu kullanılmamalıdır; bağlanacak Ryük direnç değeri çok düşük veya çok
*     yüksek değer seçilmemelidir (genelde 220-10 kΩ tercih edilir); transformatörün yönü doğru seçilmelidir (sekondere diyotların bağlanması), aksi tak-
*     dirde yüksek (230VAC) gerilimden ötürü köprü diyotlar yanar.
* 1.3 • Doğrultmaç devrelerinde transformatörün çıkışına bağlanan diyotlarla iki yönlü olarak dolaşan akım tek yönlü hâle getirilir. Ancak, diyotlar akımı
*     tam olarak doğrultamazlar. Yani elde edilen DC gerilim dalgalı (alternanslı, salınımlı) değişken doğru akımdır (salınım değeri yüksektir). Bu da alıcıların
*     düzgün çalışmasını engeller. Çıkışı tam doğru akım hâline getirebilmek için kondansatör yada bobinler kullanılarak filtre (süzgeç) devreleri yapılmıştır.
*     Filitre çeşitleri: sığaçlı, bobinli, π (pi) tiplidir. Sağdaki V6 devrede doğrultmaç devresinin çıkışına paralel bağlı olan kondansatör, çıkış sinyalini fiiltre
*     ederek düzgünleştirir. Diyottan geçen pozitif alternans maksimum değere doğru yükselirken kondansatör şarj olur. Alternans sıfır (0) değerine doğru
*     inerken ise, C=10mF üzerindeki şarj akımı alıcıya (Ryük) verir. Dolayısıyla alıcıdan geçen doğru akımın biçimi daha düzgün olur. Fiiltre olarak kullanılan
*     kondansatörün kapasite değeri büyük olursa çıkıştan alınan DC daha düzgün olur. Doğrultmaç devrelerinde alıcının çektiği akım göz önüne alınarak
*     470uF-38mF arası kapasiteye sahip kondansatörler kullanılır. Sığaç şarjı Vc=Ve*1.41, yani %41 fazla olduğundan, doğrultmaç çıkış gerilim Vmx'dan
*     azaldığı anda Ryük, Vc tarafından beslenmeye başlar. 0-->12V tamdalga 2 D düşüklüğü sonrası filitre çıkışı 10.5-->11.5V kıpırtılıdır.
*     • Bobinler "L" self endüktansına sahiptir. Bir bobinden akan akım, bir direnç üzerinden akan akıma göre 90° daha gecikmelidir. Bobinlerin bu özellikleri
*     zıt elektromotor kuvvet (EMK) üretmelerindendir. Bobinden akım geçerken, bu akımı azaltıcı etki yapar, devrenin kesilmesi anında düşen akıma da
*     büyültücü etki yapar. Sağdaki V7 devrede Ryük'e seri L irkileç 0--!2V tamdalgayı Xl seri ohmik düşüş sonrası 6.7-->7V kıpırtılıdır.
*     • Pi- π tipi filitre doğrultmaç çıkışına bağlanan paralel kondansatör, yük direnci uçları arasındaki DC gerilimdeki dalgalanmaları (ripple) azalmakta, çıkışa
*     seri olarak bağlanan şok bobini ise yük direncinden akan akım dalgalanmalarını azaltmaktadır. Sağdaki V8 devrede Vçık=10.25-->10.65 kıpırtılıdır.
*     • Filtre devresi yapımında dikkat edilmesi gereken hususlar şunlardır: Uygun ölçüde kondansatör ve/veya bobin seçilmelidir; yük direnci Ryük çok küçük
*     veya çok büyük değer seçilmemelidir; kullanılacak yere uygun filtre modeli tercih edilmelidir.
* 1.4 • Düzelteç: Ryük değişimindeDC gerilimin sabit olarak tutulduğu devrelere regüle devresi denir. Sağdaki V9 devrenin son düzelteç katının sağTıkla-->
*     OpenSchematic-->V=Table (V(In,Aj), 0,0, 1,0, 5,12, 35,12, 36,0) tabloda 3 ve 4.parametre çiftini 7,5/35,5 yerine 5,12/35,12 girerseniz Vgir=5-->35V
*     yelpazesinde, tüm yük dalgalanmasına rağmen daima Vçık=12VDC besleyecektir. Ryük=1-->10000Ω için Vyük=12V, Iyük=12A okur
K1 L1 L2 L3 1
;tran 0 220mS 20mS startup
* Vçık
K2 L4 L5 1
* Vçık
* 1Ω-->
* 1Ω-->
K3 L6 L7 1
* Vçık
K4 L8 L9 L10 1
* Vçık
K5 L11 L12 1
* Vçık
K6 L13 L14 1
* Vçık
;tran 600mS startup
K7 L15 L16 1
* Vçık
K8 L18 L19 1
* Vçık
;tran 0 1600mS 700mS startup
K9 L21 L22 1
* Vçık
* 1Ω-->
.tran 0 600mS 100mS startup
.backanno
.end